# Altium schematic sheet 1_P1.schdoc.schdoc
size 309 x 223 mm; Symbol: Sheet-Symbol_A4; Device: Sheet-Symbol_A4; Company: 杭州科技职业技术学院; Version: V1.0; Page Size: A4; @Project Name: 2024毕设; @Page Count: 1; @Update Date: 2024-05-09; @Create Date: 2024-04-28; @Schematic Name: 智能输液器主板; @Page No: 1; @Page Name: P1
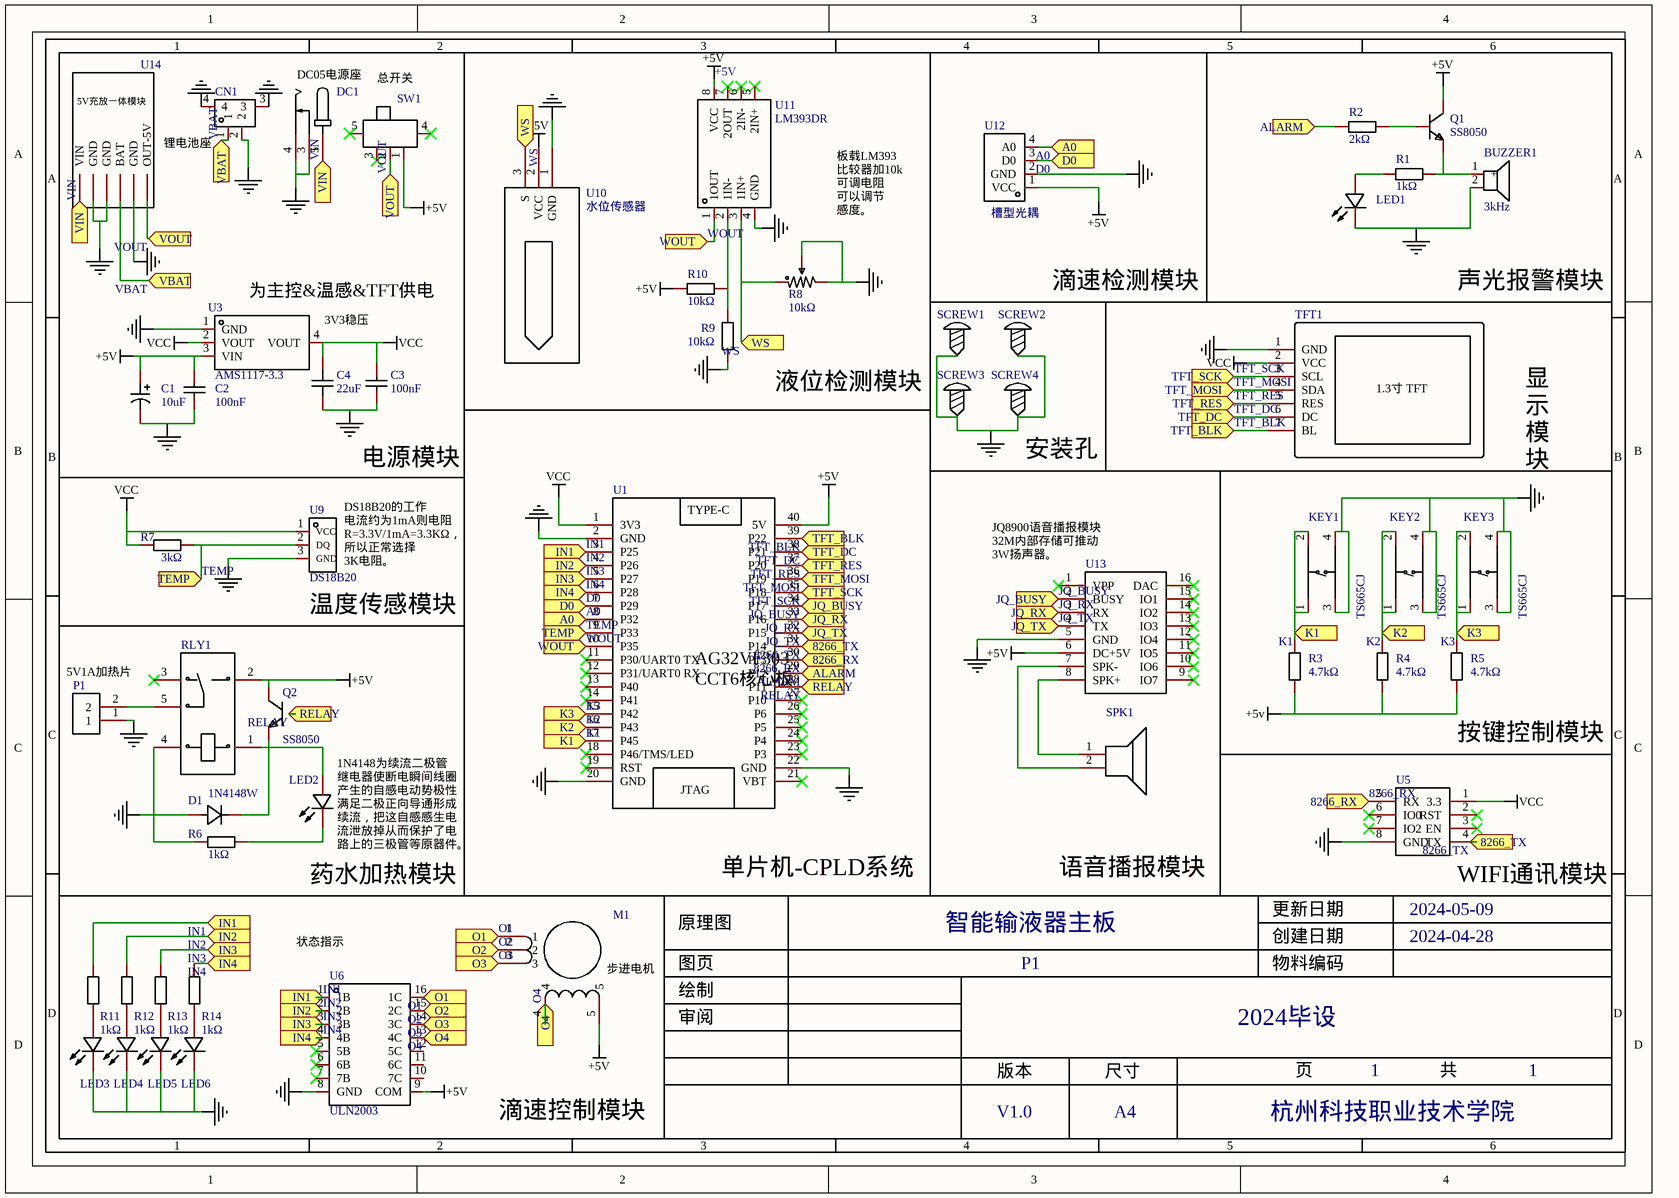
[diagram p0: 1_P1.schdoc.schdoc]

## Parts
BUZZER1  3kHz  [BUZ-TH_BD9.6-P5.00-D0.7-FD]
C1  10uF  [CAP-SMD_BD5.0-L5.3-W5.3-FD]
C2  100nF  [C0805]
C3  100nF  [C0805]
C4  22uF  [C0805]
CN1  ZX-XH2.54-2PWT  [CONN-SMD_2P-P2.54_MEGASTAR_ZX-XH2.54-2PWT]  (value not drawn)
D1  1N4148W  [SOD-123_L3.1-W1.7-LS3.7-RD]
DC1  DC-050-T20  [DC-IN-TH_DC-050-T20]  (value not drawn)
KEY1  TS665CJ  [SW-TH_4P-L6.0-W6.0-P4.50-LS6.5]
KEY2  TS665CJ  [SW-TH_4P-L6.0-W6.0-P4.50-LS6.5]
KEY3  TS665CJ  [SW-TH_4P-L6.0-W6.0-P4.50-LS6.5]
LED1  NCD0805R1  [LED0805-R-RD]  (value not drawn)
LED2  NCD0805R1  [LED0805-R-RD]  (value not drawn)
LED3  NCD0805R1  [LED0805-R-RD]  (value not drawn)
LED4  NCD0805R1  [LED0805-R-RD]  (value not drawn)
LED5  NCD0805R1  [LED0805-R-RD]  (value not drawn)
LED6  NCD0805R1  [LED0805-R-RD]  (value not drawn)
M1  步进电机  [CONN-TH_XH2.54-5AW]  (value not drawn)
P1  WJ500V-5.08-2P  [CONN-TH_2P-P5.00_WJ500V-5.08-2P]  (value not drawn)
Q1  SS8050  [SOT-23-3_L2.9-W1.3-P1.90-LS2.4-BR]
Q2  SS8050  [SOT-23-3_L2.9-W1.3-P1.90-LS2.4-BR]
R1  1kΩ  [R0805]
R2  2kΩ  [R0805]
R3  4.7kΩ  [R0805]
R4  4.7kΩ  [R0805]
R5  4.7kΩ  [R0805]
R6  1kΩ  [R0805]
R7  3kΩ  [R0805]
R8  10kΩ  [RES-ADJ-SMD_RM065-V1]
R9  10kΩ  [R0805]
R10  10kΩ  [R0805]
R11  1kΩ  [R0805]
R12  1kΩ  [R0805]
R13  1kΩ  [R0805]
R14  1kΩ  [R0805]
RLY1  SRD-05VDC-SL-C  [RELAY-TH_SRD-XXVDC-XL-C]  (value not drawn)
SCREW1  M3螺丝  [M3螺丝]  (value not drawn)
SCREW2  M3螺丝  [M3螺丝]  (value not drawn)
SCREW3  M3螺丝  [M3螺丝]  (value not drawn)
SCREW4  M3螺丝  [M3螺丝]  (value not drawn)
SPK1  扬声器  [CONN-SMD_2P-P2.54_MEGASTAR_ZX-XH2.54-2PWT]  (value not drawn)
SW1  SS12D07VG4 087  [SW-TH_SS12D07VG4]  (value not drawn)
TFT1  1.3寸TFT  [1.3寸TFT]  (value not drawn)
U1  AG32F303DEVBOARD  [AG32VF303 DEV BOARD]  (value not drawn)
U3  AMS1117-3.3  [SOT-223-3_L6.5-W3.4-P2.30-LS7.0-BR]
U5  WIFI模块  [ESP-01S]  (value not drawn)
U6  ULN2003  [SOP-16_L9.9-W3.9-P1.27-LS6.0-BL]
U9  DS18B20  [DS18B20]
U10  水位传感器  [水位传感器]
U11  LM393DR  [SOIC-8_L5.0-W4.0-P1.27-LS6.0-BL]
U12  槽型光耦  [槽型光耦]
U13  JQ8900  [JQ8900]  (value not drawn)
U14  充放电一体5V2A  [充放电一体5V2A]  (value not drawn)

## Blocks framed on the sheet
电源模块: C1-C4 CN1 DC1 SW1 U3 U14
液位检测模块: R8-R10 U10 U11
声光报警模块: BUZZER1 LED1 Q1 R1 R2
单片机-CPLD系统: U1
按键控制模块: KEY1-KEY3 R3-R5

## Ports
8266_RX (in), 8266_TX (in), A0 (in), ALARM (in), D0 (in), IN1 (in), IN2 (in), IN3 (in), IN4 (in), JQ_BUSY (in), JQ_RX (in), JQ_TX (in), K1 (in), K2 (in), K3 (in), O1 (in), O2 (in), O3 (in), O4 (in), RELAY (in), TEMP (in), TFT_BLK (in), TFT_DC (in), TFT_MOSI (in), TFT_RES (in), TFT_SCK (in), VBAT (in), VIN (in), VOUT (in), WOUT (in), WS (in)

## Nets
+5V: C1.1 C2.2 M1.5 Q1.3(C) Q2.3(C) R3.2 R4.2 R5.2 R10.2 RLY1.2 SW1.1 U1.40(5V) U3.3(VIN) U6.9(COM) U10.2(VCC) U11.8(VCC) U12.1(VCC) U13.6(DC+5V)
NetBUZZER1_2: BUZZER1.2 C1.2 C2.1 C3.1 C4.1 CN1.2 CN1.3 CN1.4 D1.2(A) DC1.3 DC1.4 KEY1.3(C) KEY1.4(D) KEY2.3(C) KEY2.4(D) KEY3.3(C) KEY3.4(D) LED1.2(-) LED3.2(-) LED4.2(-) LED5.2(-) LED6.2(-) P1.1 R6.2 R8.2 R8.3 R9.1 RLY1.4 SCREW1.1 SCREW2.1 SCREW3.1 SCREW4.1 TFT1.1(GND) U1.2(GND) U1.20(GND) U1.22(GND) U3.1(GND) U5.8(GND) U6.8(GND) U9.3(GND) U10.1(GND) U11.4(GND) U12.2(GND) U13.5(GND) U14.2(GND) U14.3(GND) U14.5(GND)
VCC: C3.2 C4.2 R7.1 TFT1.2(VCC) U1.1(3V3) U3.2(VOUT) U3.4(VOUT) U5.1(3.3) U9.1(VCC)
8266_RX: U1.30(P13) U5.5(RX) ; port 8266_RX
8266_TX: U1.31(P14) U5.4(TX) ; port 8266_TX
A0: U1.8(P32) U12.4(A0) ; port A0
ALARM: R2.1 U1.29(P12) ; port ALARM
D0: U1.7(P29) U12.3(D0) ; port D0
IN1: R11.1 U1.3(P25) U6.1(1B) ; port IN1
IN2: R12.1 U1.4(P26) U6.2(2B) ; port IN2
IN3: R13.1 U1.5(P27) U6.3(3B) ; port IN3
IN4: R14.1 U1.6(P28) U6.4(4B) ; port IN4
JQ_BUSY: U1.34(P17) U13.2(BUSY) ; port JQ_BUSY
JQ_RX: U1.33(P16) U13.3(RX) ; port JQ_RX
JQ_TX: U1.32(P15) U13.4(TX) ; port JQ_TX
K1: KEY1.1(A) KEY1.2(B) R3.1 U1.17(P45) ; port K1
K2: KEY2.1(A) KEY2.2(B) R4.1 U1.16(P43) ; port K2
K3: KEY3.1(A) KEY3.2(B) R5.1 U1.15(P42) ; port K3
O1: M1.1 U6.16(1C) ; port O1
O2: M1.2 U6.15(2C) ; port O2
O3: M1.3 U6.14(3C) ; port O3
O4: M1.4 U6.13(4C) ; port O4
RELAY: U1.28(P11) ; port RELAY
TEMP: R7.2 U1.9(P33) U9.2(DQ) ; port TEMP
TFT_BLK: TFT1.7(BL) U1.39(P22) ; port TFT_BLK
TFT_DC: TFT1.6(DC) U1.38(P21) ; port TFT_DC
TFT_MOSI: TFT1.4(SDA) U1.36(P19) ; port TFT_MOSI
TFT_RES: TFT1.5(RES) U1.37(P20) ; port TFT_RES
TFT_SCK: TFT1.3(SCL) U1.35(P18) ; port TFT_SCK
VBAT: CN1.1 U14.4(BAT) ; port VBAT
VIN: DC1.5 U14.1(VIN) ; port VIN
VOUT: SW1.2 U14.6(OUT-5V) ; port VOUT
WOUT: U1.10(P35) U11.1(1OUT) ; port WOUT
WS: R8.1 U10.3(S) U11.3(1IN+) ; port WS
NetBUZZER1_1: BUZZER1.1(+) Q1.2(E) R1.1
NetD1_1: D1.1(K) LED2.1(+) Q2.2(E) RLY1.1
NetLED1_1: LED1.1(+) R1.2
NetLED2_2: LED2.2(-) R6.1
NetLED3_1: LED3.1(+) R11.2
NetLED4_1: LED4.1(+) R12.2
NetLED5_1: LED5.1(+) R13.2
NetLED6_1: LED6.1(+) R14.2
NetP1_2: P1.2 RLY1.5
NetQ1_1: Q1.1(B) R2.2
NetR9_2: R9.2 R10.1 U11.2(1IN-)
NetSPK1_1: SPK1.1(+) U13.8(SPK+)
NetSPK1_2: SPK1.2(-) U13.7(SPK-)

Not connected (* = marked no-connect by the designer): Q2 1(B); RLY1 3*; SW1 3* 4* 5*; U1 11(P30/UART0_TX)* 12(P31/UART0_RX)* 13(P40)* 14(P41)* 18(P46/TMS/LED)* 19(RST)* 21(VBT)* 23(P3)* 24(P4)* 25(P5)* 26(P6)* 27(P10)*; U5 2(RST)* 3(EN)* 6(IO0)* 7(IO2)*; U6 5(5B)* 6(6B)* 7(7B)* 10(7C) 11(6C) 12(5C); U11 5(2IN+)* 6(2IN-)* 7(2OUT)*; U13 1(VPP)* 9(IO7)* 10(IO6)* 11(IO5)* 12(IO4)* 13(IO3)* 14(IO2)* 15(IO1)* 16(DAC)*

## Notes on the sheet
- DC05电源座
- 5V充放一体模块
- 总开关
- (near R8) 板载LM393
  比较器加10k
  可调电阻
  可以调节
  感度。
- 锂电池座
- (near U3) 为主控&温感&TFT供电
- (near U3) 3V3稳压
- 滴速检测模块
- 显
  示
  模
  块
- (near SCREW4) 安装孔
- (near U9) DS18B20的工作
  电流约为1mA则电阻
  R=3.3V/1mA=3.3KΩ，
  所以正常选择
  3K电阻。
- (near U13) JQ8900语音播报模块
  32M内部存储可推动
  3W扬声器。
- (near P1) 5V1A加热片
- (near U9) 温度传感模块
- (near LED2) 1N4148为续流二极管
  继电器使断电瞬间线圈
  产生的自感电动势极性
  满足二极正向导通形成
  续流，把这自感感生电
  流泄放掉从而保护了电
  路上的三极管等原器件。
- 语音播报模块
- (near U6) 状态指示
- 药水加热模块
- (near U5) WIFI通讯模块
- (near M1) 步进电机
- 滴速控制模块
- 1
- 2
- 3
- 4
- 5
- 6
- A
- B
- C
- 原理图
- 智能输液器主板
- 创建日期
- 更新日期
- 2024-05-09
- 2024-04-28
- D
- 审阅
- 绘制
- 图页
- P1
- 物料编码
- 2024毕设
- 版本
- 尺寸
- 页
- 共
- V1.0
- A4
- 杭州科技职业技术学院
- (in symbol 1.3寸TFT) 1.3寸 TFT
- (in symbol AG32F303DEVBOARD) TYPE-C; AG32VF303 / CCT6核心板; JTAG

## Library data of the parts
BUZZER1 = HNB09A05: Manufacturer: 华能; Add into BOM: yes; Oscillator Circuit: 有源(内含驱动线路); Technology Type: 电磁式; Operating Voltage: 4V~8V; Sound Pressure Level (SPL): 85dB; Description: 驱动方式:有源(内含驱动线路);构造类型:电磁式;频率:3kHz;声压(SPL):85dB;; Name: 3kHz; Symbol: HNB09A05; Device: HNB09A05; LCSC Part Name: HNB09A05; Supplier Part: C96493; Manufacturer Part: HNB09A05; Supplier Footprint: 插件,D=9mm; JLCPCB Part Class: 扩展库; Datasheet: https://atta.szlcsc.com/upload/public/pdf/source/20170522/1495448327549.pdf; Supplier: LCSC; Convert to PCB: yes; Value: 3kHz; Diameter (φD): 9mm; Height: 5.7mm
C1 = RST10UF50V016: Manufacturer: KNSCHA(科尼盛); Add into BOM: yes; Tolerance: ±20%; Rated Voltage: 50V; Ripple Current: 24mA@120Hz; φD: 5mm; L: 5.4mm; Lifetime @ Temp: 2000hrs@105℃; Description: 容值:10uF;精度:±20%;额定电压:50V;纹波电流:24mA@120Hz;等效串联电阻:-;; Name: 10uF; Symbol: RST10UF50V016; Device: RST10UF50V016; Supplier: LCSC; Supplier Part: C4747971; Manufacturer Part: RST10UF50V016; Value: 10uF; JLCPCB Part Class: 扩展库; LCSC Part Name: 10uF ±20% 50V; Supplier Footprint: SMD,D5xL5.4mm; Datasheet: https://atta.szlcsc.com/upload/public/pdf/source/20220722/47144637C831FC4476CE4962252D8002.pdf; Convert to PCB: yes; Equivalent Series Resistance(ESR): -; Operating Temperature: -40℃~+105℃
C2 C3 = CC0805KRX7R9BB104: Manufacturer: YAGEO(国巨); Add into BOM: yes; Tolerance: ±10%; Voltage Rated: 50V; Temperature Coefficient: X7R; Description: 容值:100nF;精度:±10%;额定电压:50V;材质(温度系数):X7R;; Name: 100nF; Symbol: CC0805KRX7R9BB104; Device: CC0805KRX7R9BB104; LCSC Part Name: 100nF ±10% 50V; Supplier Part: C49678; Manufacturer Part: CC0805KRX7R9BB104; Supplier Footprint: 0805; JLCPCB Part Class: 基础库; Datasheet: https://atta.szlcsc.com/upload/public/pdf/source/20180224/C181747_15194369449651363981.pdf; Supplier: LCSC; Convert to PCB: yes; Value: 100nF
C4 = CL21A226MAQNNNE: Manufacturer: SAMSUNG(三星); Add into BOM: yes; Tolerance: ±20%; Voltage Rated: 25V; Temperature Coefficient: X5R; Description: 容值:22uF;精度:±20%;额定电压:25V;材质(温度系数):X5R;; Name: 22uF; Symbol: CL21A226MAQNNNE; Device: CL21A226MAQNNNE; LCSC Part Name: 22uF ±20% 25V; Supplier Part: C45783; Manufacturer Part: CL21A226MAQNNNE; Supplier Footprint: 0805; JLCPCB Part Class: 基础库; Datasheet: https://atta.szlcsc.com/upload/public/pdf/source/20160218/1457707763339.pdf; Supplier: LCSC; Convert to PCB: yes; Value: 22uF
CN1 = ZX-XH2.54-2PWT: Manufacturer: Megastar(兆星); Add into BOM: yes; Pins Structure: 1x2P; Pitch: 2.54mm; Reference Series: XH; Number of PINs Per Row: 2; Current Rating (Max): 3A; Description: 插针结构:1x2P;间距:2.54mm;安装方式:卧贴;参考系列:XH;总PIN数:2P;排数:1;每排PIN数:2;行距:-;额定电流:3A;触头材质:黄铜;触头镀层:锡;工作温度范围:-25℃~+85℃;; Name: ZX-XH2.54-2PWT; Symbol: ZX-XH2.54-2PWT; Device: ZX-XH2.54-2PWT; Supplier: LCSC; Supplier Part: C7429671; Manufacturer Part: ZX-XH2.54-2PWT; JLCPCB Part Class: 扩展库; LCSC Part Name: ZX-XH2.54-2PWT; Supplier Footprint: SMD,P=2.54mm,卧贴; Datasheet: https://atta.szlcsc.com/upload/public/pdf/source/20230619/D2020A0565D707024C90AEAD14B7AF42.pdf; Convert to PCB: yes; Mounting Style: 卧贴; Number of Pins: 2P; Number of Rows: 1; Row Spacing: -; Contact Material: 黄铜; Contact Plating: 锡; Operating Temperature Range: -25℃~+85℃
D1 = 1N4148W_C727110: Manufacturer: TWGMC(台湾迪嘉); Add into BOM: yes; Diode Configuration: 独立式; Forward Voltage (Vf@If): 1.5V@300mA; Reverse Voltage (Vr): 100V; Average Rectified Current (Io): 300mA; Power Dissipation: 400mW; Reverse Leakage Current: 1uA@75V; Reverse Recovery Time (trr): 8ns; Description: 二极管配置:独立式;正向压降(Vf):1.5V@300mA;直流反向耐压(Vr):100V;平均整流电流(Io):300mA;功率:400mW;反向恢复时间(trr):8ns;; Name: 1N4148W; Symbol: 1N4148W_C727110; Device: 1N4148W_C727110; Supplier: LCSC; Supplier Part: C727110; Manufacturer Part: 1N4148W; JLCPCB Part Class: 扩展库; LCSC Part Name: 电压:100V 电流:300mA; Supplier Footprint: SOD-123; Datasheet: https://atta.szlcsc.com/upload/public/pdf/source/20200828/C727110_99AC3443E5714B605FD2E8FDF6DB8A39.pdf; Convert to PCB: yes; Operating Temperature: -55℃~+150℃@(Tj)
DC1 = DC-050-T20: Manufacturer: SOFNG(硕方); Add into BOM: yes; Inside Contact Diameter: 2mm; Outside Contact Diameter: 6.4mm; Current Rating (Max): 500mA; Voltage Rating (Max): 30V; Description: 触点内径:2mm;触点外径:6.4mm;额定电流:500mA;额定电压:30V;; Name: DC-050-T20; Symbol: DC-050-T20; Device: DC-050-T20; LCSC Part Name: 内径:2mm 外径:6.4mm; Supplier Part: C114916; Manufacturer Part: DC-050-T20; Supplier Footprint: SMD; JLCPCB Part Class: 扩展库; Datasheet: https://atta.szlcsc.com/upload/public/pdf/source/20180619/C114916_60F30FBCF1C6CC2CDE982971E48D1788.pdf; Supplier: LCSC; Convert to PCB: yes
KEY1-KEY3 = TS665CJ: Manufacturer: SHOU HAN(首韩); Add into BOM: yes; Circuit: 单刀单掷; Actuator Style: 圆形按钮; Switch Length: 6mm; Switch Height: 5mm; Contact Current: 50mA; Voltage Rating (DC): 12V; Description: 电路结构:单刀单掷;按钮形状:圆形按钮;安装方式:直插;开关长度:6mm;开关宽度:6mm;开关高度:5mm;触点电流:50mA;额定电压(DC):12V;带灯:-;机械寿命:-;; Name: TS665CJ; Symbol: TS665CJ; Device: TS665CJ; Supplier: LCSC; Supplier Part: C393938; Manufacturer Part: TS665CJ; JLCPCB Part Class: 扩展库; LCSC Part Name: 6*6*5mm 直插 轻触开关; Supplier Footprint: 插件; Datasheet: https://atta.szlcsc.com/upload/public/pdf/source/20190521/C393938_BDABEAC600B4C55E200A80AA129B70BC.pdf; Convert to PCB: yes; Mounting Style: 直插; Switch Width: 6mm; With Lamp: -; Mechanical Life: -
LED1-LED6 = NCD0805R1: Manufacturer: 国星光电; Symbol: FC-2012HRK-620D; Add into BOM: yes; Emitted Color: 红色; Forward Voltage (VF): 1.6V~2.6V; Power Dissipation: 65mW; Forward Current: 20mA; Dominant Wavelength: 615nm~630nm; Diode Configuration: 独立二极管; Lens Color: 无色透明透镜; Luminous Intensity: 67mcd~195mcd; Viewing Angle: 130°; Description: 灯头类型:-;发光颜色:红色;正向电压(VF):1.6V~2.6V;功率:65mW;正向电流:20mA;主波长:615nm~630nm;二极管配置:独立二极管;透镜颜色:无色透明透镜;色温:-;发光强度:67mcd~195mcd;发光角度:130°;载带方式:-;工作温度:-30℃~+85℃;; Device: NCD0805R1; Supplier: LCSC; Manufacturer Part: NCD0805R1; Supplier Part: C84256; JLCPCB Part Class: 基础库; LCSC Part Name: NCD0805R1; Supplier Footprint: 0805; Datasheet: https://atta.szlcsc.com/upload/public/pdf/source/20200820/C84256_F0A75A43B3EAD75808600A0514C76B99.pdf; Convert to PCB: yes; Lamp Holder Type: -; Peak Wavelength: -; Color Temperature: -; Mounting Sytle: -; Operating Temperature: -30℃~+85℃
M1 = 步进电机: Add into BOM: yes; Symbol: 步进电机; Device: 步进电机; Convert to PCB: yes
P1 = WJ500V-5.08-2P: Manufacturer: KANGNEX(康奈克斯电气); Symbol: WJ500V-5.08-2P-14-00A; Add into BOM: yes; Structure: 1x2P; Pitch: 5.08mm; Current Rating (Max): 18A; Voltage Rating (Max): 250V; Wire Gauge - AWG: 14~30; Wire Gauge - mm2: 2.5; Number of PINs Per Row: 2; Screw Specification: M2.5; Description: 结构:1x2P;间距:5.08mm;颜色:绿色;安装方式:直插;额定电流:18A;额定电压:250V;排数:1;线规 - AWG:14~30;线规 - 平方毫米:2.5;每排PIN数:2;触头材质:-;触头镀层:-;工作温度范围:-40℃~+105℃;焊接温度(最大值):-;; Name: WJ500V-5.08-2P; Device: WJ500V-5.08-2P; LCSC Part Name: 1x2P 5.08mm 直插 排数:1 每排P数:2; Supplier Part: C8465; Manufacturer Part: WJ500V-5.08-2P; Supplier Footprint: 插件,P=5.08mm; JLCPCB Part Class: 扩展库; Datasheet: https://atta.szlcsc.com/upload/public/pdf/source/20191225/C8465_02D34CE5B5B4A53DF5891601D97FA9F4.pdf; Supplier: LCSC; Convert to PCB: yes; Color: 绿色; Mounting Style: 直插; Number of Pins: 2P; Number of Rows: 1; Contact Material: -; Contact Plating: -; Operating Temperature Range: -40℃~+105℃; Soldering Temperature(Max): -
Q1 Q2 = SS8050_C7420370: Manufacturer: 宏迦橙; Add into BOM: yes; Transistor Type: NPN; Collector Current (Ic): 1.5A; Collector-Emitter Breakdown Voltage (Vceo): 25V; Power Dissipation (Pd): 300mW; DC Current Gain (hFE@Ic,Vce): 120@100mA,1.0V; Transition Frequency (fT): 100MHz; Collector Cut-Off Current (Icbo): 100nA; Collector-Emitter Saturation Voltage (VCE(sat)@Ic,Ib): 500mV@800mA,80mA; Description: 晶体管类型:NPN;集电极电流(Ic):1.5A;集射极击穿电压(Vceo):25V;功率(Pd):300mW;直流电流增益(hFE@Ic,Vce):120@100mA,1.0V;; Name: SS8050; Symbol: SS8050_C7420370; Device: SS8050_C7420370; Supplier: LCSC; Supplier Part: C7420370; Manufacturer Part: SS8050; JLCPCB Part Class: 扩展库; LCSC Part Name: 耐压:25V 电流:1.5A NPN H档 200-350; Supplier Footprint: SOT-23; Datasheet: https://atta.szlcsc.com/upload/public/pdf/source/20231222/9C4050A7669EB24B3ACD0418218817FD.pdf; Convert to PCB: yes; Operating Temperature: -55℃~+150℃
R1 R6 R11-R14 = 0805W8F1001T5E: Manufacturer: UNI-ROYAL(厚声); Add into BOM: yes; Tolerance: ±1%; Power(Watts): 125mW; Overload Voltage (Max): 150V; Temperature Coefficient: ±100ppm/℃; Description: 电阻类型:厚膜电阻;阻值:1kΩ;精度:±1%;功率:125mW;最大工作电压:150V;温度系数:±100ppm/℃;; Name: 1kΩ; Symbol: 0805W8F1001T5E; Device: 0805W8F1001T5E; LCSC Part Name: 1kΩ ±1% 125mW 厚膜电阻; Supplier Part: C17513; Manufacturer Part: 0805W8F1001T5E; Supplier Footprint: 0805; JLCPCB Part Class: 基础库; Datasheet: https://atta.szlcsc.com/upload/public/pdf/source/20200306/C422600_1E6D84923E4A46A82E41ADD87F860B5C.pdf; Supplier: LCSC; Convert to PCB: yes; Type: 厚膜电阻; Value: 1kΩ; Operating Temperature Range: -55℃~+155℃
R2 = 0805W8F2001T5E: Manufacturer: UNI-ROYAL(厚声); Add into BOM: yes; Tolerance: ±1%; Power(Watts): 125mW; Overload Voltage (Max): 150V; Temperature Coefficient: ±100ppm/℃; Description: 电阻类型:厚膜电阻;阻值:2kΩ;精度:±1%;功率:125mW;最大工作电压:150V;温度系数:±100ppm/℃;; Name: 2kΩ; Symbol: 0805W8F2001T5E; Device: 0805W8F2001T5E; Supplier: LCSC; Manufacturer Part: 0805W8F2001T5E; Supplier Part: C17604; Value: 2kΩ; JLCPCB Part Class: 基础库; LCSC Part Name: 2kΩ ±1% 125mW 厚膜电阻; Supplier Footprint: 0805; Datasheet: https://atta.szlcsc.com/upload/public/pdf/source/20200306/C422600_1E6D84923E4A46A82E41ADD87F860B5C.pdf; Convert to PCB: yes; Type: 厚膜电阻; Operating Temperature Range: -55℃~+155℃
R3-R5 R7 = 0805W8F4701T5E: Manufacturer: UNI-ROYAL(厚声); Add into BOM: yes; Tolerance: ±1%; Power(Watts): 125mW; Overload Voltage (Max): 150V; Temperature Coefficient: ±100ppm/℃; Description: 电阻类型:厚膜电阻;阻值:4.7kΩ;精度:±1%;功率:125mW;最大工作电压:150V;温度系数:±100ppm/℃;; Symbol: 0805W8F4701T5E; Device: 0805W8F4701T5E; Supplier: LCSC; Manufacturer Part: 0805W8F4701T5E; Supplier Part: C17673; JLCPCB Part Class: 基础库; LCSC Part Name: 4.7kΩ ±1% 125mW 厚膜电阻; Supplier Footprint: 0805; Datasheet: https://atta.szlcsc.com/upload/public/pdf/source/20200306/C422600_1E6D84923E4A46A82E41ADD87F860B5C.pdf; Convert to PCB: yes; Type: 厚膜电阻; Operating Temperature Range: -55℃~+155℃
  R3-R5: Name: 4.7kΩ; Value: 4.7kΩ
  R7: Name: 3kΩ; Value: 3kΩ
R8 = RM065-103(10K): Manufacturer: BOCHEN(博晨); Add into BOM: yes; Tolerance: ±25%; Power(Watts): 100mW; Description: 阻值:10kΩ;精度:±25%;功率:100mW;; Name: 10kΩ; Symbol: RM065-103(10K); Device: RM065-103(10K); LCSC Part Name: 10kΩ ±25%; Supplier Part: C5205021; Manufacturer Part: RM065-103(10K); Supplier Footprint: 插件; JLCPCB Part Class: 扩展库; Datasheet: https://atta.szlcsc.com/upload/public/pdf/source/20221019/6263C46FBC7F1B66CBAADA74DC5EFAA2.pdf; Supplier: LCSC; Convert to PCB: yes; Value: 10kΩ
R9 R10 = 0805W8F1002T5E_C17414: Manufacturer: UNI-ROYAL(厚声); Add into BOM: yes; Tolerance: ±1%; Power(Watts): 125mW; Overload Voltage (Max): 150V; Temperature Coefficient: ±100ppm/℃; Description: 电阻类型:厚膜电阻;阻值:10kΩ;精度:±1%;功率:125mW;最大工作电压:150V;温度系数:±100ppm/℃;; Name: 10kΩ; Symbol: 0805W8F1002T5E; Device: 0805W8F1002T5E_C17414; Supplier: LCSC; Manufacturer Part: 0805W8F1002T5E; Supplier Part: C17414; Value: 10kΩ; JLCPCB Part Class: 基础库; LCSC Part Name: 10kΩ ±1% 125mW 厚膜电阻; Supplier Footprint: 0805; Datasheet: https://atta.szlcsc.com/upload/public/pdf/source/20200306/C422600_1E6D84923E4A46A82E41ADD87F860B5C.pdf; Convert to PCB: yes; Type: 厚膜电阻; Operating Temperature Range: -55℃~+155℃
RLY1 = SRD-05VDC-SL-C: Manufacturer: 松乐; Add into BOM: yes; Coil Voltage: 5V; Contact Form: 一组转换:1C(单刀双掷-转换); Pin Number: 5; Maximum Switching Voltage: 250V@AC; Coil Rated Power: 360mW; Maximum Switching Current: 15A; Coil Type: 无极性-单线圈; Coil Resistance: 70Ω; Contact Resistance: 100mΩ; Operate Time: 10ms; Description: 线圈电压:5V;触点形式:一组转换:1C(单刀双掷-转换);触点容量(电阻负载):-;最大切换电压:250V@AC;最大切换电流:15A;; Name: SRD-05VDC-SL-C; Symbol: SRD-05VDC-SL-C; Device: SRD-05VDC-SL-C; LCSC Part Name: 蓝色; Supplier Part: C35449; Manufacturer Part: SRD-05VDC-SL-C; Supplier Footprint: 插件,15.6x19.2mm; JLCPCB Part Class: 扩展库; Datasheet: https://atta.szlcsc.com/upload/public/pdf/source/20200305/C490149_C96E4098A3B1FFB377D5AD2E40B7C2A8.pdf; Supplier: LCSC; Convert to PCB: yes; Contact Rating: -; Release Time: 10ms
SCREW1-SCREW4 = M3螺丝: Symbol: 螺丝孔; Convert to PCB: yes; Device: M3螺丝; Add into BOM: yes; Supplier Footprint: 插件
SPK1 = 扬声器: Add into BOM: yes; Description: 功率8Ω1W，直径40mm，材料内磁纸盆; Symbol: 扬声器; Device: 扬声器; Convert to PCB: yes
SW1 = SS12D07VG4 087: Manufacturer: SHOU HAN(首韩); Add into BOM: yes; Circuit: 单刀双掷; Pin Style: PC引脚; Switch Length: 8.7mm; Switch Width: 4.4mm; Switch Height: 4.7mm; Current Rating (DC): 500mA; Voltage Rating (DC): 50V; Mechanical Life: 5千次; Description: 电路结构:单刀双掷;安装方式:直插;开关颜色:-;额定电流(DC):500mA;额定电压(DC):50V;额定电流(AC):-;额定电压(AC):-;机械寿命:5千次;; Name: SS12D07VG4 087; Symbol: SS12D07VG4 087; Device: SS12D07VG4 087; LCSC Part Name: SS12D07VG4 087; Supplier Part: C2939726; Manufacturer Part: SS12D07VG4 087; Supplier Footprint: 插件; JLCPCB Part Class: 扩展库; Datasheet: https://atta.szlcsc.com/upload/public/pdf/source/20220106/E715996F66241B9FD900079FF66489BE.pdf; Supplier: LCSC; Convert to PCB: yes; Actuator Style: -; Mounting Style: 直插; Actuator Color: -; Current Rating (AC): -; Voltage Rating (AC): -; Operating Temperature: -10℃~+50℃
TFT1 = 1.3寸TFT: Add into BOM: yes; Symbol: 1.3寸TFT; Device: 1.3寸TFT; Convert to PCB: yes
U1 = AG32F303DEVBOARD: Add into BOM: yes; Symbol: AG32F303DEVBOARD; Device: AG32F303DEVBOARD; Convert to PCB: yes
U3 = AMS1117-3.3_C6186: Manufacturer: AMS; Add into BOM: yes; Output Type: 固定; Output Voltage: 3.3V; MAX Output Current: 1A; Power Supply Rejection Ratio (PSRR): 72dB@(120Hz); Dropout Voltage: 1.3V@(800mA); Output Polarity: 正极; Number of Outputs: 1; Description: 输出类型:固定;最大输入电压:-;输出电压:3.3V;最大输出电流:1A;电源纹波抑制比(PSRR):72dB@(120Hz);输出极性:正极;; Name: AMS1117-3.3; Symbol: AMS1117-3.3; Device: AMS1117-3.3_C6186; Supplier: LCSC; Manufacturer Part: AMS1117-3.3; Supplier Part: C6186; JLCPCB Part Class: 基础库; LCSC Part Name: 输出3.3V 1A; Supplier Footprint: SOT-223-3; Datasheet: https://atta.szlcsc.com/upload/public/pdf/source/20180727/C6186_7A095716F0823C02F1997A905E26C086.pdf; Convert to PCB: yes; Maximum Input Voltage: -; standby current: -; Noise: -; Feature: -; Operating Temperature: -
U5 = WIFI模块: Add into BOM: yes; Symbol: WIFI模块; Device: WIFI模块; Convert to PCB: yes
U6 = ULN2003_C2829422: Manufacturer: CJ(江苏长电/长晶); Add into BOM: yes; number of channels: 七路; Maximum collector Emitter Voltage (Vceo): 50V; Collector Current(Ic): 500mA; maximum input voltage: 30V; Description: 通道数:七路;集射击穿电压(Vceo):50V;集电极电流(Ic):500mA;; Name: ULN2003; Symbol: ULN2003_C2829422; Device: ULN2003_C2829422; LCSC Part Name: ULN2003; Supplier Part: C2829422; Manufacturer Part: ULN2003; Supplier Footprint: SOP-16; JLCPCB Part Class: 扩展库; Datasheet: https://atta.szlcsc.com/upload/public/pdf/source/20210820/14D6B38FEFC9E3D5438A6EEAB232DF5F.pdf; Supplier: LCSC; Convert to PCB: yes
U9 = DS18B20: Manufacturer: ZHOURI(洲日); Manufacturer Part: XH-3PA; Add into BOM: yes; Name: DS18B20; Symbol: DS18B20; Device: DS18B20; LCSC Part Name: XH-3PA; Supplier Part: C5258884; Supplier Footprint: 插件,P=2.5mm; JLCPCB Part Class: 扩展库; Datasheet: https://atta.szlcsc.com/upload/public/pdf/source/20221111/941C48A64A881023E1ECD9BB647261A0.pdf; Supplier: LCSC; Convert to PCB: yes
U10 = 水位传感器: Add into BOM: yes; Name: 水位传感器; Symbol: 水位传感器; Device: 水位传感器; Convert to PCB: yes
U11 = LM393DR: Manufacturer: TI(德州仪器); Add into BOM: yes; Input Offset Voltage (Vos): 5mV; Input Bias Current (Ib): 250nA; Supply Voltage: 1V~18V；2V~36V; Output Type: 开集; Supply Current: 2.5mA; Description: 输入失调电压(Vos):5mV;输入偏置电流(Ib):250nA;; Name: LM393DR; Symbol: LM393DR; Device: LM393DR; LCSC Part Name: LM393DR; Supplier Part: C67470; Manufacturer Part: LM393DR; Supplier Footprint: SOIC-8; JLCPCB Part Class: 扩展库; Datasheet: https://www.ti.com/cn/lit/gpn/lm393; Supplier: LCSC; Convert to PCB: yes; Input Hysteresis Voltage (Vhys): -; Common Mode Rejection Ratio (CMRR): -; Output Mode: -; Operating Temperature: 0℃~+70℃
U12 = XH-4PA: Manufacturer: ZHOURI(洲日); Add into BOM: yes; Name: 槽型光耦; Symbol: XH-4PA; Device: XH-4PA; LCSC Part Name: XH-4PA; Supplier Part: C5258885; Manufacturer Part: XH-4PA; Supplier Footprint: 插件,P=2.5mm; JLCPCB Part Class: 扩展库; Datasheet: https://atta.szlcsc.com/upload/public/pdf/source/20221111/941C48A64A881023E1ECD9BB647261A0.pdf; Supplier: LCSC; Convert to PCB: yes
U13 = JQ8900: Add into BOM: yes; _: 3; Symbol: JQ8900; Device: JQ8900; Convert to PCB: yes
U14 = 充放电一体5V2A: Add into BOM: yes; Symbol: 充放电一体5V2A; Device: 充放电一体5V2A; Convert to PCB: yes